# EAGLE design connector_final_rev01 (EAGLE 9.6.0)
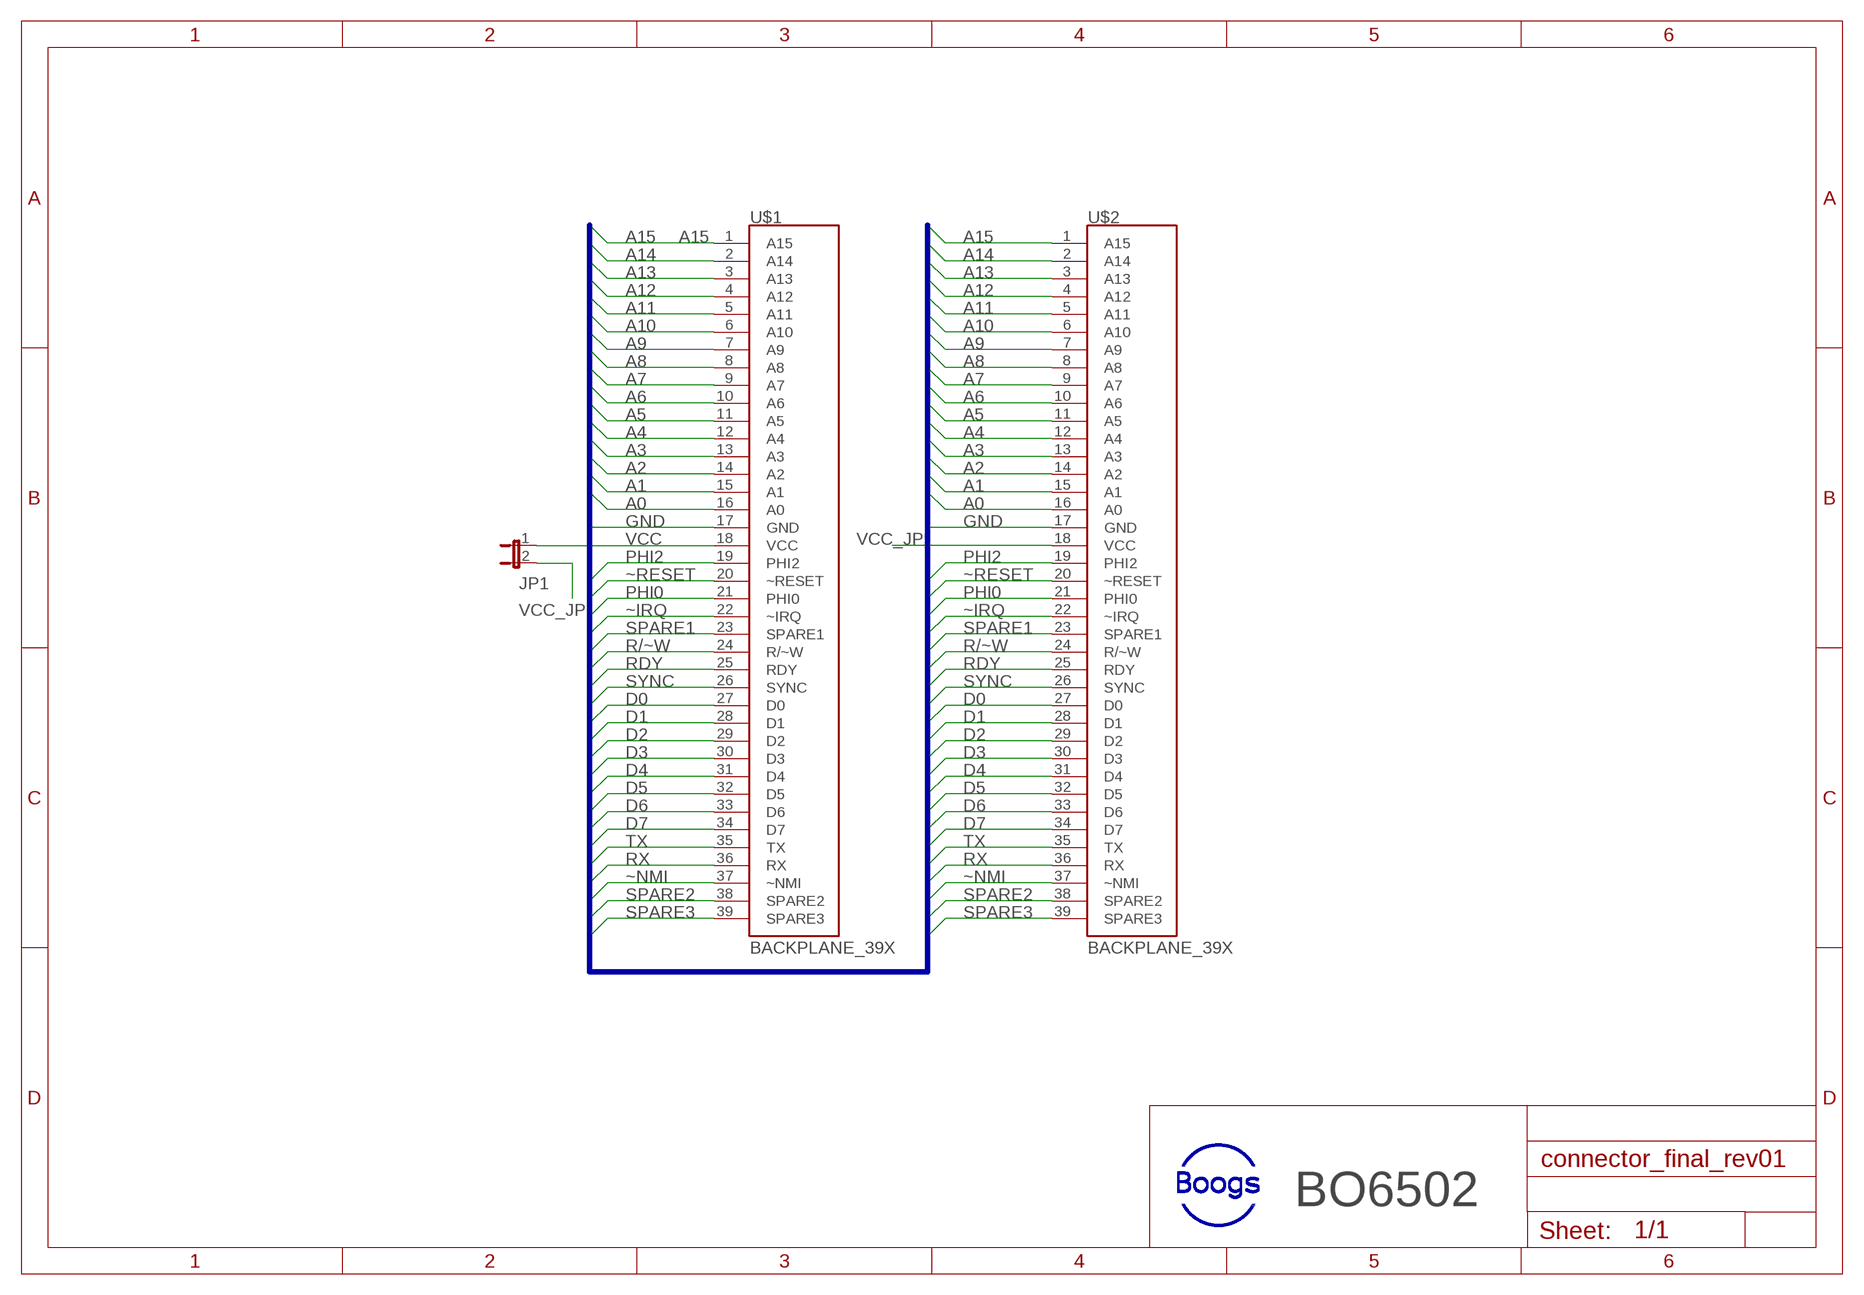
[diagram p0: schematic, sheet 1]

## Parts
JP1  JP1E  [JP1]
U$1  BACKPLANE_39X  [BP_39X]
U$2  BACKPLANE_39X  [BP_39X]

## Nets
A0: U$1.16(A0) U$2.16(A0)
A1: U$1.15(A1) U$2.15(A1)
A2: U$1.14(A2) U$2.14(A2)
A3: U$1.13(A3) U$2.13(A3)
A4: U$1.12(A4) U$2.12(A4)
A5: U$1.11(A5) U$2.11(A5)
A6: U$1.10(A6) U$2.10(A6)
A7: U$1.9(A7) U$2.9(A7)
A8: U$1.8(A8) U$2.8(A8)
A9: U$1.7(A9) U$2.7(A9)
A10: U$1.6(A10) U$2.6(A10)
A11: U$1.5(A11) U$2.5(A11)
A12: U$1.4(A12) U$2.4(A12)
A13: U$1.3(A13) U$2.3(A13)
A14: U$1.2(A14) U$2.2(A14)
A15: U$1.1(A15) U$2.1(A15)
D0: U$1.27(D0) U$2.27(D0)
D1: U$1.28(D1) U$2.28(D1)
D2: U$1.29(D2) U$2.29(D2)
D3: U$1.30(D3) U$2.30(D3)
D4: U$1.31(D4) U$2.31(D4)
D5: U$1.32(D5) U$2.32(D5)
D6: U$1.33(D6) U$2.33(D6)
D7: U$1.34(D7) U$2.34(D7)
GND: U$1.17(GND) U$2.17(GND)
PHI0: U$1.21(PHI0) U$2.21(PHI0)
PHI2: U$1.19(PHI2) U$2.19(PHI2)
R/~W: U$1.24(R/~W) U$2.24(R/~W)
RDY: U$1.25(RDY) U$2.25(RDY)
RX: U$1.36(RX) U$2.36(RX)
SPARE1: U$1.23(SPARE1) U$2.23(SPARE1)
SPARE2: U$1.38(SPARE2) U$2.38(SPARE2)
SPARE3: U$1.39(SPARE3) U$2.39(SPARE3)
SYNC: U$1.26(SYNC) U$2.26(SYNC)
TX: U$1.35(TX) U$2.35(TX)
VCC: JP1.1 U$1.18(VCC)
VCC_JP: JP1.2 U$2.18(VCC)
~IRQ: U$1.22(~IRQ) U$2.22(~IRQ)
~NMI: U$1.37(~NMI) U$2.37(~NMI)
~RESET: U$1.20(~RESET) U$2.20(~RESET)

## Buses
A0,A1,A2,A3,A4,A5,A6,A7,A8,A9,A10,A11,A12,A13,A14,A15,D0,D1,D2,D3,D4,D5,D6,D7,GND,~IRQ,~NMI,PHI0,PHI2,RDY,~RESET,R/~W,RX,SPARE1,SPARE2,SPARE3,SYNC,TX

## Notes on the sheet
- BO6502

## Library data of the parts
JP1 = jumper:JP1E: JUMPER
U$1 = 65xx_family:BACKPLANE_39X; A15: A15
U$2 = 65xx_family:BACKPLANE_39X

## Board
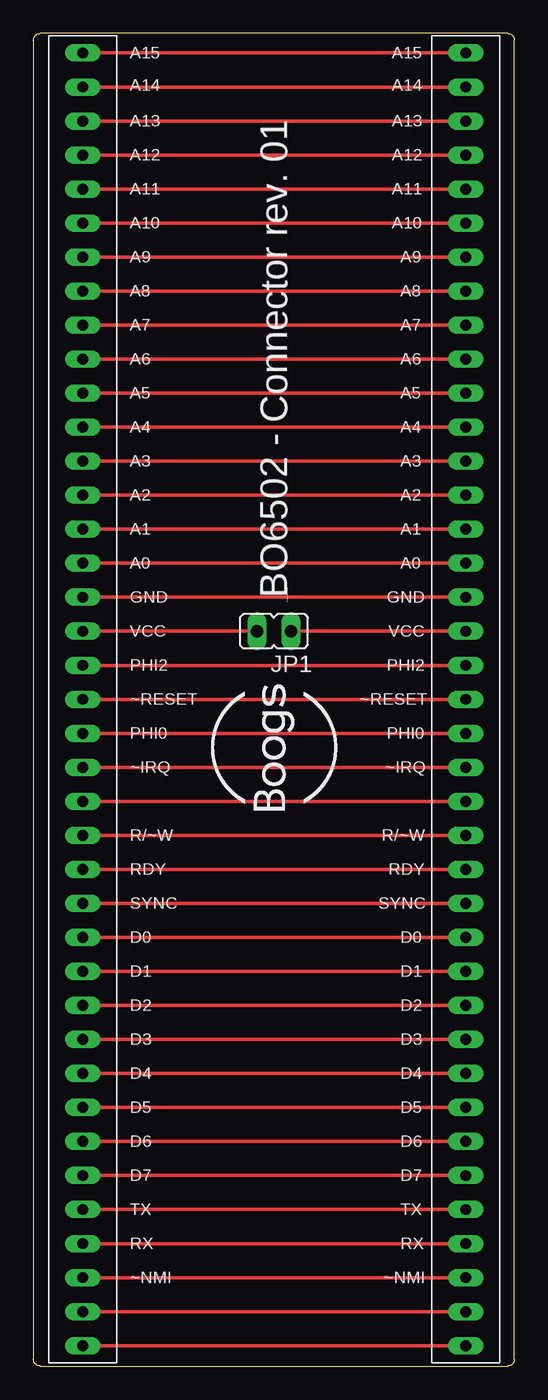
[diagram p1: board, top side]

Size 35.9 x 99.5 mm. Coordinates in mm from the lower left corner, seen from the top.
Outline: 0.5,0 35.4,0 arc90 35.9,0.5 35.9,99 arc90 35.4,99.5 0.5,99.5 arc90 0,99 0,0.5 arc90 0.5,0
Copper layers (1*16): Top 0.035mm / dielectric 1.5mm / Bottom 0.035mm
Design rules "default *": minimum track width 10mil, minimum drill 0.35mm, track to track 10mil, track to pad 10mil, pad to pad 10mil, via to via 10mil, smd to smd 6mil, copper to edge 40mil, drill to drill 6mil, minimum pad ring 10mil, minimum via ring 8mil, stop-mask expansion 4mil, vias tented up to drill 0mil, thermal gap 10mil

### Footprints (pad centres in the part's own frame; a part is rotated, then mirrored left to right if it is on the bottom)
JP1 = drill 0.914 long: 1 0,-1.27; 2 0,1.27
BP_39X = drill 0.813 long: 1 1.27,59.69; 2 1.27,57.15; 3 1.27,54.61; 4 1.27,52.07; 5 1.27,49.53; 6 1.27,46.99; 7 1.27,44.45; 8 1.27,41.91; 9 1.27,39.37; 10 1.27,36.83; 11 1.27,34.29; 12 1.27,31.75; 13 1.27,29.21; 14 1.27,26.67; 15 1.27,24.13; 16 1.27,21.59; 17 1.27,19.05; 18 1.27,16.51; 19 1.27,13.97; 20 1.27,11.43; 21 1.27,8.89; 22 1.27,6.35; 23 1.27,3.81; 24 1.27,1.27; 25 1.27,-1.27; 26 1.27,-3.81; 27 1.27,-6.35; 28 1.27,-8.89; 29 1.27,-11.43; 30 1.27,-13.97; 31 1.27,-16.51; 32 1.27,-19.05; 33 1.27,-21.59; 34 1.27,-24.13; 35 1.27,-26.67; 36 1.27,-29.21; 37 1.27,-31.75; 38 1.27,-34.29; 39 1.27,-36.83

### Placement (x,y rotation side)
JP1  17.95,54.86 270 top
U$1  2.41,38.35 0 top
U$2  30.99,38.35 0 top

### Tracks (layer width: path | path; a pad name or v marks a point on that pad's centre or on a via)
A0
  Top 0.254: U$2.16 U$1.16
A1
  Top 0.254: U$2.15 U$1.15
A2
  Top 0.254: U$2.14 U$1.14
A3
  Top 0.254: U$2.13 U$1.13
A4
  Top 0.254: U$2.12 U$1.12
A5
  Top 0.254: U$2.11 U$1.11
A6
  Top 0.254: U$2.10 U$1.10
A7
  Top 0.254: U$2.9 U$1.9
A8
  Top 0.254: U$2.8 U$1.8
A9
  Top 0.254: U$2.7 U$1.7
A10
  Top 0.254: U$2.6 U$1.6
A11
  Top 0.254: U$2.5 U$1.5
A12
  Top 0.254: U$2.4 U$1.4
A13
  Top 0.254: U$2.3 U$1.3
A14
  Top 0.254: U$2.2 U$1.2
A15
  Top 0.254: U$2.1 U$1.1
D0
  Top 0.254: U$2.27 U$1.27
D1
  Top 0.254: U$2.28 U$1.28
D2
  Top 0.254: U$2.29 U$1.29
D3
  Top 0.254: U$2.30 U$1.30
D4
  Top 0.254: U$2.31 U$1.31
D5
  Top 0.254: U$2.32 U$1.32
D6
  Top 0.254: U$2.33 U$1.33
D7
  Top 0.254: U$2.34 U$1.34
GND
  Top 0.254: U$2.17 U$1.17
PHI0
  Top 0.254: U$2.21 U$1.21
PHI2
  Top 0.254: U$2.19 U$1.19
R/~W
  Top 0.254: U$2.24 U$1.24
RDY
  Top 0.254: U$2.25 U$1.25
RX
  Top 0.254: U$2.36 U$1.36
SPARE1
  Top 0.254: U$2.23 U$1.23
SPARE2
  Top 0.254: U$2.38 U$1.38
SPARE3
  Top 0.254: U$2.39 U$1.39
SYNC
  Top 0.254: U$2.26 U$1.26
TX
  Top 0.254: U$2.35 U$1.35
VCC
  Top 0.254: JP1.1 U$1.18
VCC_JP
  Top 0.254: JP1.2 U$2.18
~IRQ
  Top 0.254: U$2.22 U$1.22
~NMI
  Top 0.254: U$2.37 U$1.37
~RESET
  Top 0.254: U$2.20 U$1.20

### Text on the board
tNames: A15 | A15 | A14 | A14 | A13 | A13 | A12 | A12 | A11 | A11 | A10 | A10 | A9 | A9 | A8 | A8 | A7 | A7 | A6 | A6 | A5 | A5 | A4 | A4 | A3 | A3 | A2 | A2 | A1 | A1 | A0 | A0 | GND | BO6502 - Connector rev. 01 | GND | VCC | VCC | PHI2 | PHI2 | ~RESET | ~RESET | PHI0 | PHI0 | ~IRQ | ~IRQ | R/~W | R/~W | RDY | RDY | SYNC | SYNC | D0 | D0 | D1 | D1 | D2 | D2 | D3 | D3 | D4 | D4 | D5 | D5 | D6 | D6 | D7 | D7 | TX | TX | RX | RX | ~NMI | ~NMI
bNames: BO6502 - Connector rev. 01